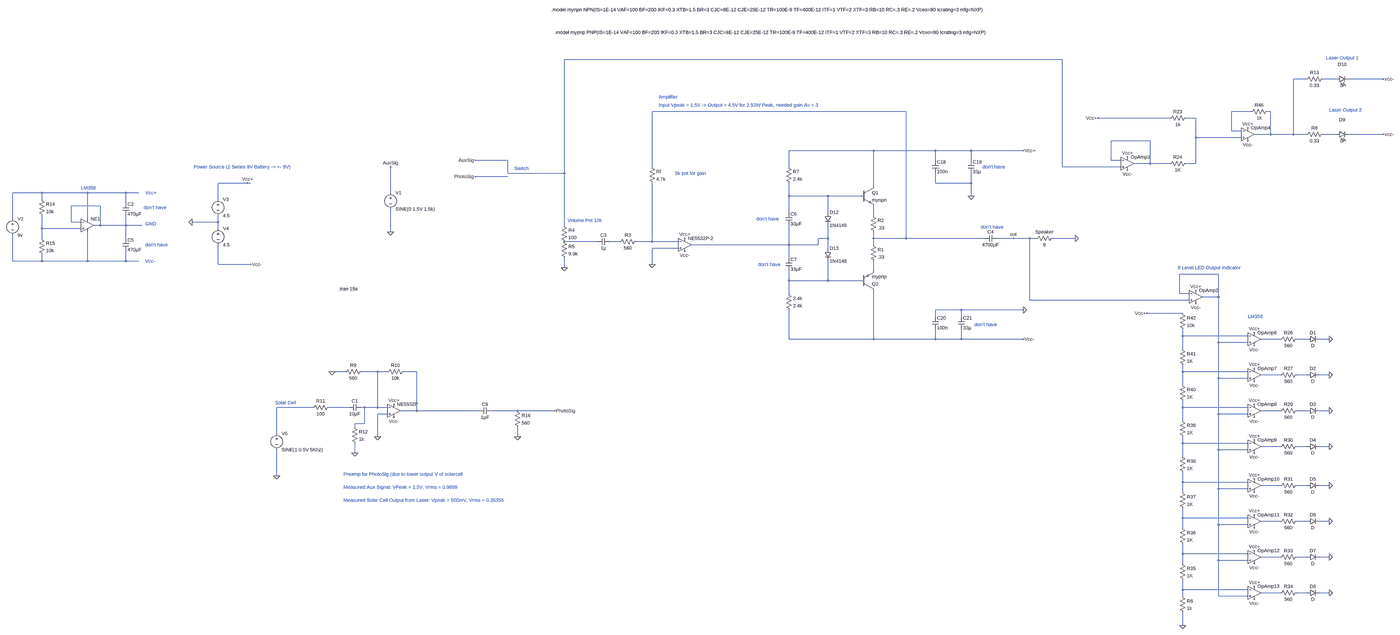
[diagram p0: schematic 20250907- Project 1 - Final.asc, whole sheet]
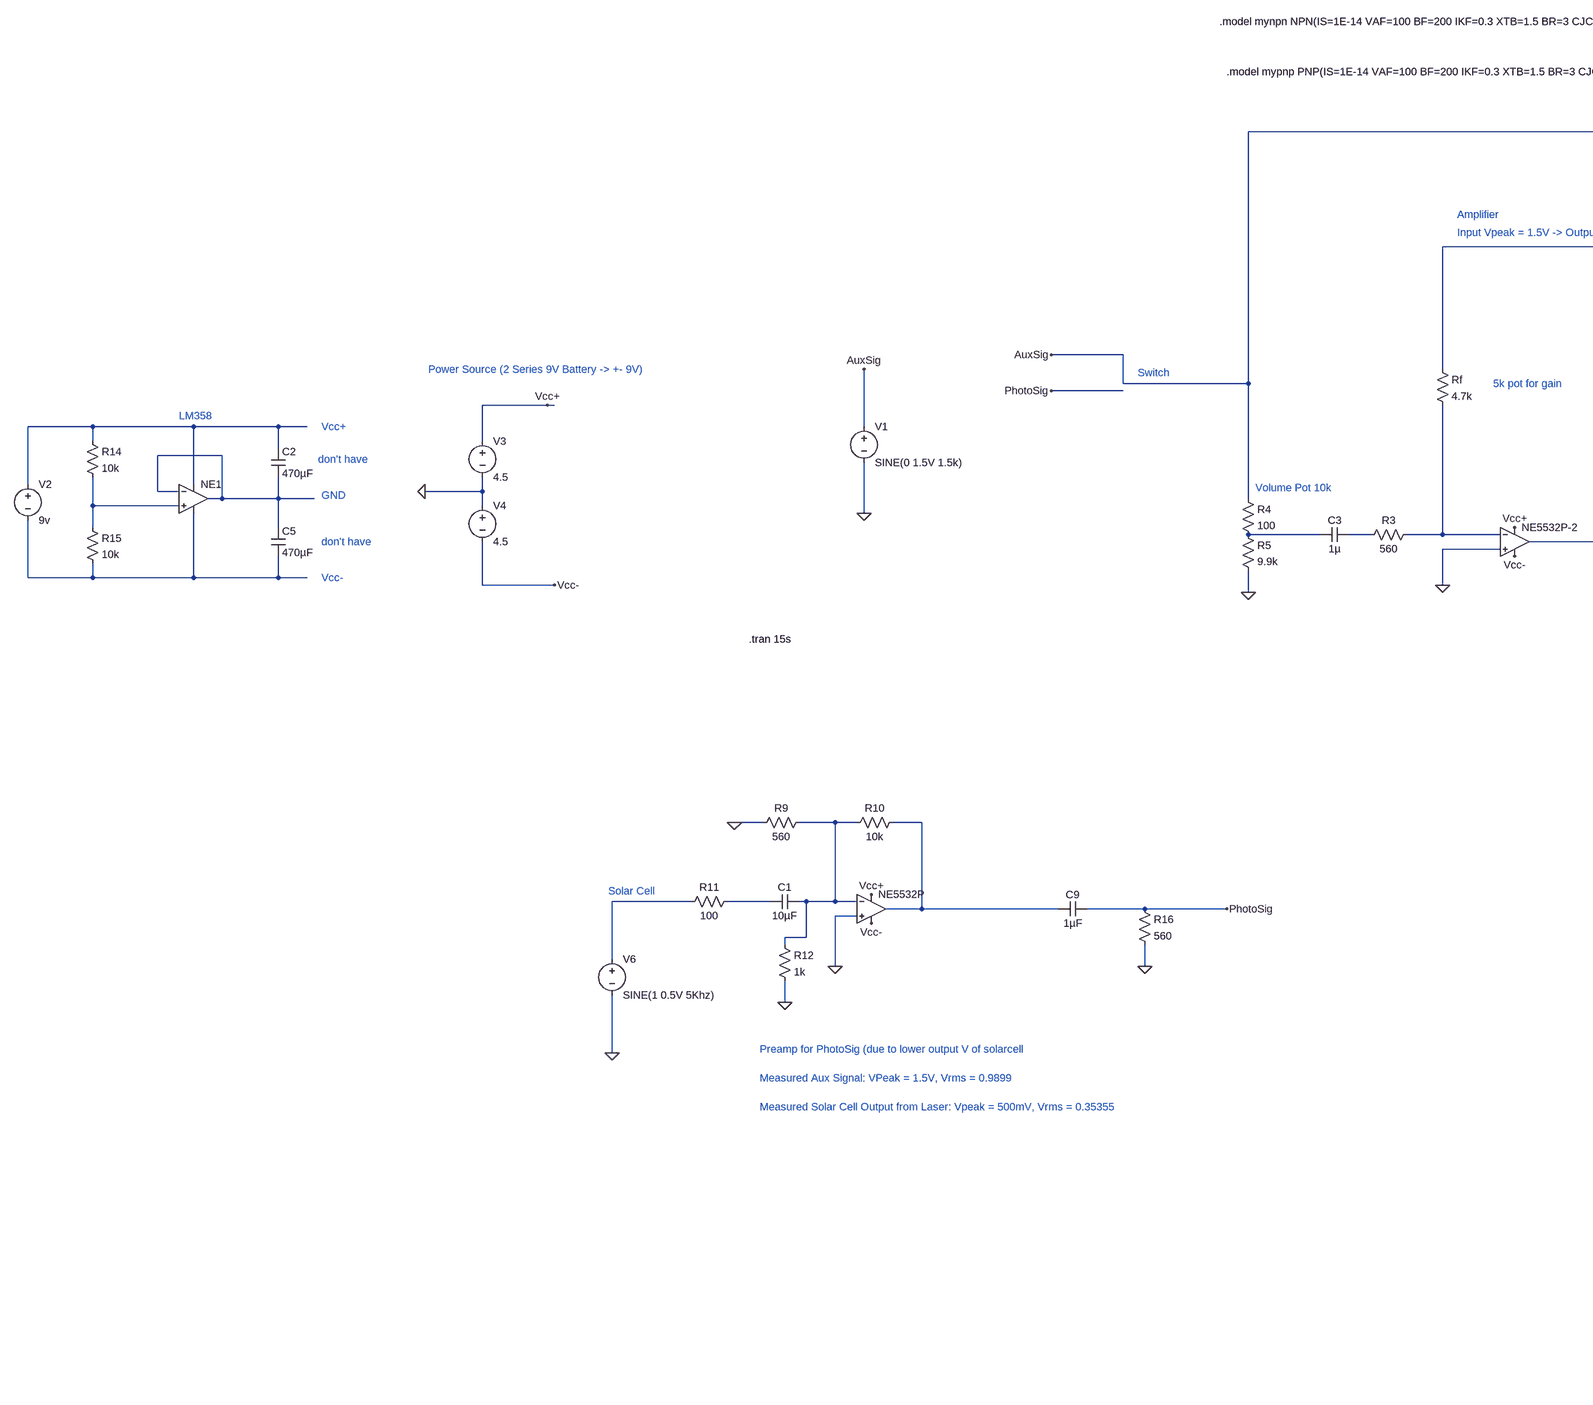
[diagram p1: schematic 20250907- Project 1 - Final.asc, part, row 1 of 1, column 1 of 2]
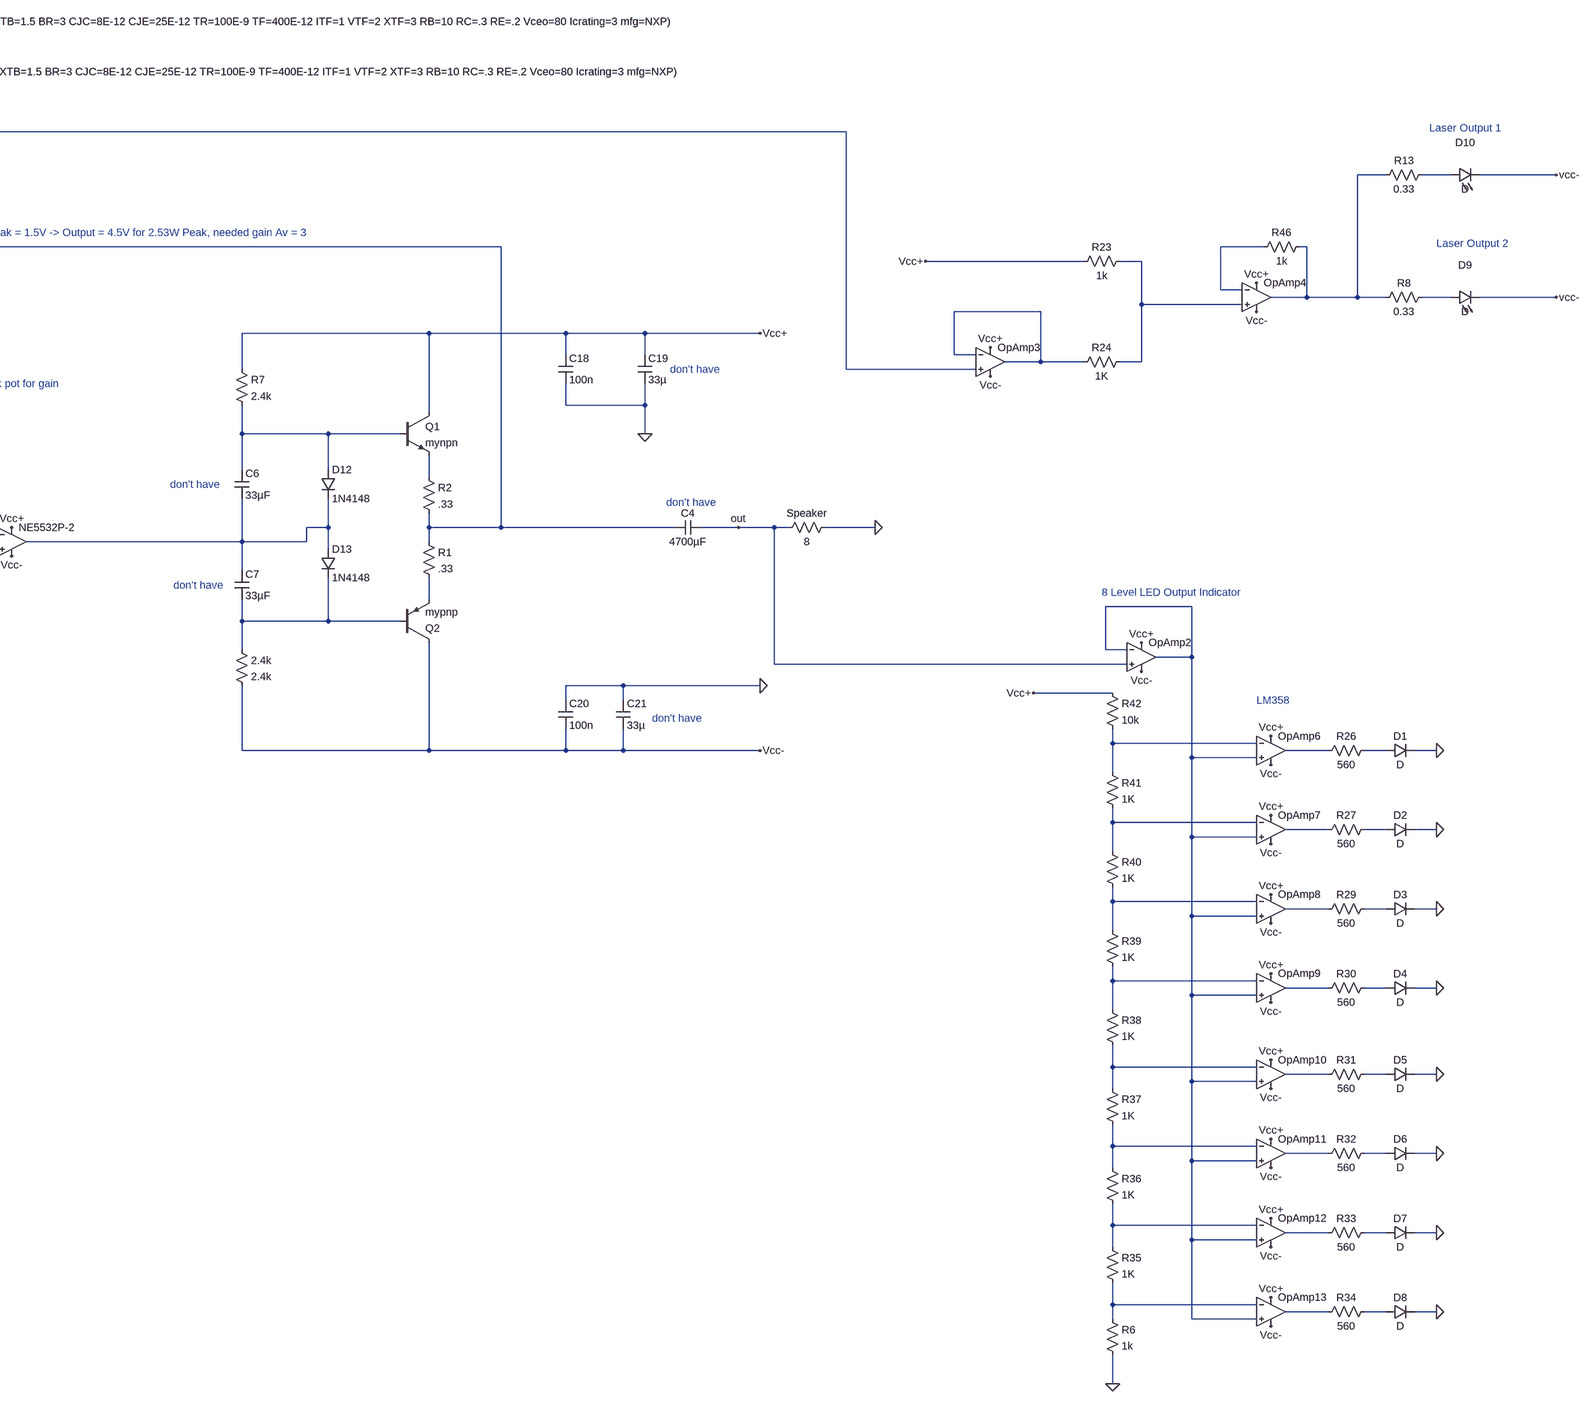
[diagram p2: schematic 20250907- Project 1 - Final.asc, part, row 1 of 1, column 2 of 2]
20250907- Project 1 - Final.asc, the LTspice schematic file:
Version 4
SHEET 1 9492 3776
WIRE 4880 -1648 2432 -1648
WIRE 6080 -1552 6016 -1552
WIRE 6224 -1552 6160 -1552
WIRE 6480 -1552 6288 -1552
WIRE 4112 -1392 2864 -1392
WIRE 5808 -1392 5712 -1392
WIRE 5904 -1392 5888 -1392
WIRE 5408 -1360 5056 -1360
WIRE 5536 -1360 5488 -1360
WIRE 5712 -1296 5712 -1392
WIRE 5760 -1296 5712 -1296
WIRE 5904 -1280 5904 -1392
WIRE 5904 -1280 5824 -1280
WIRE 6016 -1280 6016 -1552
WIRE 6016 -1280 5904 -1280
WIRE 6080 -1280 6016 -1280
WIRE 6224 -1280 6160 -1280
WIRE 6480 -1280 6288 -1280
WIRE 5536 -1264 5536 -1360
WIRE 5760 -1264 5536 -1264
WIRE 5312 -1248 5120 -1248
WIRE 3952 -1200 3536 -1200
WIRE 4256 -1200 3952 -1200
WIRE 4432 -1200 4256 -1200
WIRE 4688 -1200 4432 -1200
WIRE 2144 -1152 1984 -1152
WIRE 4256 -1152 4256 -1200
WIRE 4432 -1152 4432 -1200
WIRE 5120 -1152 5120 -1248
WIRE 5168 -1152 5120 -1152
WIRE 5312 -1136 5312 -1248
WIRE 5312 -1136 5232 -1136
WIRE 5408 -1136 5312 -1136
WIRE 5536 -1136 5536 -1264
WIRE 5536 -1136 5488 -1136
WIRE 2864 -1120 2864 -1392
WIRE 3536 -1120 3536 -1200
WIRE 4880 -1120 4880 -1648
WIRE 5168 -1120 4880 -1120
WIRE 2144 -1088 2144 -1152
WIRE 2432 -1088 2432 -1648
WIRE 2432 -1088 2144 -1088
WIRE 2144 -1072 1984 -1072
WIRE 864 -1040 720 -1040
WIRE 880 -1040 864 -1040
WIRE 4256 -1040 4256 -1088
WIRE 4432 -1040 4432 -1088
WIRE 4432 -1040 4256 -1040
WIRE 3952 -1024 3952 -1200
WIRE -288 -992 -432 -992
WIRE -64 -992 -288 -992
WIRE 128 -992 -64 -992
WIRE 192 -992 128 -992
WIRE 1568 -992 1568 -1120
WIRE 3536 -976 3536 -1040
WIRE 3728 -976 3536 -976
WIRE 3888 -976 3728 -976
WIRE 4432 -976 4432 -1040
WIRE -288 -960 -288 -992
WIRE 720 -960 720 -1040
WIRE 128 -944 128 -992
WIRE 0 -928 -144 -928
WIRE 3536 -896 3536 -976
WIRE 3728 -896 3728 -976
WIRE 3952 -880 3952 -928
WIRE -432 -864 -432 -992
WIRE -64 -864 -64 -992
WIRE -144 -848 -144 -928
WIRE -96 -848 -144 -848
WIRE 720 -848 720 -880
WIRE 720 -848 592 -848
WIRE 0 -832 0 -928
WIRE 0 -832 -32 -832
WIRE 128 -832 128 -880
WIRE 128 -832 0 -832
WIRE 208 -832 128 -832
WIRE 2432 -832 2432 -1088
WIRE -288 -816 -288 -880
WIRE -96 -816 -288 -816
WIRE 720 -816 720 -848
WIRE 1568 -800 1568 -912
WIRE -288 -768 -288 -816
WIRE 128 -768 128 -832
WIRE 3728 -768 3728 -832
WIRE 3728 -768 3680 -768
WIRE 3952 -768 3952 -800
WIRE 4112 -768 4112 -1392
WIRE 4112 -768 3952 -768
WIRE 4496 -768 4112 -768
WIRE 4640 -768 4560 -768
WIRE 4720 -768 4640 -768
WIRE 4752 -768 4720 -768
WIRE 4944 -768 4832 -768
WIRE 2592 -752 2432 -752
WIRE 2704 -752 2656 -752
WIRE 2864 -752 2864 -1040
WIRE 2864 -752 2784 -752
WIRE 2992 -752 2864 -752
WIRE 3536 -736 3536 -832
WIRE 3536 -736 3056 -736
WIRE 3680 -736 3680 -768
WIRE 3680 -736 3536 -736
WIRE 3952 -736 3952 -768
WIRE 2992 -720 2864 -720
WIRE 3728 -720 3728 -768
WIRE 3536 -672 3536 -736
WIRE -432 -656 -432 -784
WIRE -288 -656 -288 -688
WIRE -288 -656 -432 -656
WIRE -64 -656 -64 -800
WIRE -64 -656 -288 -656
WIRE 128 -656 128 -704
WIRE 128 -656 -64 -656
WIRE 192 -656 128 -656
WIRE 720 -640 720 -736
WIRE 880 -640 720 -640
WIRE 2864 -640 2864 -720
WIRE 2432 -624 2432 -672
WIRE 3952 -608 3952 -656
WIRE 5648 -592 5456 -592
WIRE 3536 -560 3536 -608
WIRE 3728 -560 3728 -656
WIRE 3728 -560 3536 -560
WIRE 3888 -560 3728 -560
WIRE 3536 -496 3536 -560
WIRE 5456 -496 5456 -592
WIRE 5504 -496 5456 -496
WIRE 5648 -480 5648 -592
WIRE 5648 -480 5568 -480
WIRE 4720 -464 4720 -768
WIRE 5504 -464 4720 -464
WIRE 4384 -416 4256 -416
WIRE 4688 -416 4384 -416
WIRE 5472 -400 5296 -400
WIRE 4256 -384 4256 -416
WIRE 4384 -384 4384 -416
WIRE 5472 -288 5472 -320
WIRE 5792 -288 5472 -288
WIRE 3536 -272 3536 -416
WIRE 3952 -272 3952 -512
WIRE 3952 -272 3536 -272
WIRE 4256 -272 4256 -320
WIRE 4256 -272 3952 -272
WIRE 4384 -272 4384 -320
WIRE 4384 -272 4256 -272
WIRE 4688 -272 4384 -272
WIRE 5952 -272 5856 -272
WIRE 6080 -272 6032 -272
WIRE 6192 -272 6144 -272
WIRE 5648 -256 5648 -480
WIRE 5792 -256 5648 -256
WIRE 5472 -224 5472 -288
WIRE 1280 -112 1264 -112
WIRE 1344 -112 1280 -112
WIRE 1504 -112 1424 -112
WIRE 1552 -112 1504 -112
WIRE 1696 -112 1632 -112
WIRE 5472 -112 5472 -144
WIRE 5792 -112 5472 -112
WIRE 5952 -96 5856 -96
WIRE 6080 -96 6032 -96
WIRE 6192 -96 6144 -96
WIRE 5648 -80 5648 -256
WIRE 5792 -80 5648 -80
WIRE 5472 -48 5472 -112
WIRE 1184 64 1008 64
WIRE 1360 64 1264 64
WIRE 1440 64 1424 64
WIRE 1504 64 1504 -112
WIRE 1504 64 1440 64
WIRE 1552 64 1504 64
WIRE 5472 64 5472 32
WIRE 5792 64 5472 64
WIRE 1696 80 1696 -112
WIRE 1696 80 1616 80
WIRE 2000 80 1696 80
WIRE 2192 80 2064 80
WIRE 2384 80 2192 80
WIRE 5952 80 5856 80
WIRE 6080 80 6032 80
WIRE 6192 80 6144 80
WIRE 1552 96 1504 96
WIRE 5648 96 5648 -80
WIRE 5792 96 5648 96
WIRE 5472 128 5472 64
WIRE 1440 144 1440 64
WIRE 1440 144 1392 144
WIRE 1392 160 1392 144
WIRE 1008 192 1008 64
WIRE 1504 208 1504 96
WIRE 2192 208 2192 160
WIRE 5472 240 5472 208
WIRE 5792 240 5472 240
WIRE 5952 256 5856 256
WIRE 6080 256 6032 256
WIRE 6192 256 6144 256
WIRE 5648 272 5648 96
WIRE 5792 272 5648 272
WIRE 1392 288 1392 240
WIRE 5472 304 5472 240
WIRE 1008 400 1008 272
WIRE 5472 432 5472 384
WIRE 5792 432 5472 432
WIRE 5952 448 5856 448
WIRE 6080 448 6032 448
WIRE 6192 448 6144 448
WIRE 5648 464 5648 272
WIRE 5792 464 5648 464
WIRE 5472 480 5472 432
WIRE 5472 608 5472 560
WIRE 5792 608 5472 608
WIRE 5952 624 5856 624
WIRE 6080 624 6032 624
WIRE 6192 624 6144 624
WIRE 5648 640 5648 464
WIRE 5792 640 5648 640
WIRE 5472 656 5472 608
WIRE 5472 784 5472 736
WIRE 5792 784 5472 784
WIRE 5952 800 5856 800
WIRE 6080 800 6032 800
WIRE 6192 800 6144 800
WIRE 5648 816 5648 640
WIRE 5792 816 5648 816
WIRE 5472 832 5472 784
WIRE 5472 960 5472 912
WIRE 5792 960 5472 960
WIRE 5952 976 5856 976
WIRE 6080 976 6032 976
WIRE 6192 976 6144 976
WIRE 5472 992 5472 960
WIRE 5648 992 5648 816
WIRE 5792 992 5648 992
WIRE 5472 1136 5472 1072
FLAG 1568 -1120 AuxSig
FLAG 6192 -96 0
FLAG 6192 80 0
FLAG 6192 256 0
FLAG 6192 448 0
FLAG 6192 624 0
FLAG 6192 800 0
FLAG 6192 976 0
FLAG 5296 -400 Vcc+
FLAG 6192 -272 0
FLAG 5056 -1360 Vcc+
FLAG 3024 -768 Vcc+
FLAG 3024 -704 Vcc-
FLAG 2864 -640 0
FLAG 4944 -768 0
FLAG 4640 -768 out
FLAG 4432 -976 0
FLAG 4688 -416 0
FLAG 4688 -272 Vcc-
FLAG 4688 -1200 Vcc+
FLAG 5536 -512 Vcc+
FLAG 5536 -448 Vcc-
FLAG 5200 -1168 Vcc+
FLAG 5200 -1104 Vcc-
FLAG 5792 -1312 Vcc+
FLAG 5792 -1248 Vcc-
FLAG 5824 -304 Vcc+
FLAG 5824 -240 Vcc-
FLAG 5824 -128 Vcc+
FLAG 5824 -64 Vcc-
FLAG 5824 48 Vcc+
FLAG 5824 112 Vcc-
FLAG 5824 224 Vcc+
FLAG 5824 288 Vcc-
FLAG 5824 416 Vcc+
FLAG 5824 480 Vcc-
FLAG 5824 592 Vcc+
FLAG 5824 656 Vcc-
FLAG 5824 768 Vcc+
FLAG 5824 832 Vcc-
FLAG 5824 944 Vcc+
FLAG 5824 1008 Vcc-
FLAG 2432 -624 0
FLAG 1504 208 0
FLAG 1584 48 Vcc+
FLAG 1584 112 Vcc-
FLAG 2384 80 PhotoSig
FLAG 592 -848 0
FLAG 864 -1040 Vcc+
FLAG 880 -640 Vcc-
FLAG 6480 -1280 vcc-
FLAG 1008 400 0
FLAG 5472 1136 0
FLAG 1984 -1152 AuxSig
FLAG 1984 -1072 PhotoSig
FLAG 1280 -112 0
FLAG 1392 288 0
FLAG 6480 -1552 vcc-
FLAG 1568 -800 0
FLAG 2192 208 0
SYMBOL diode 6080 -256 R270
WINDOW 0 32 32 VTop 2
WINDOW 3 0 32 VBottom 2
SYMATTR InstName D1
SYMBOL res 6048 -288 R90
WINDOW 0 0 56 VBottom 2
WINDOW 3 32 56 VTop 2
SYMATTR InstName R26
SYMATTR Value 560
SYMBOL diode 6080 -80 R270
WINDOW 0 32 32 VTop 2
WINDOW 3 0 32 VBottom 2
SYMATTR InstName D2
SYMBOL res 6048 -112 R90
WINDOW 0 0 56 VBottom 2
WINDOW 3 32 56 VTop 2
SYMATTR InstName R27
SYMATTR Value 560
SYMBOL diode 6080 96 R270
WINDOW 0 32 32 VTop 2
WINDOW 3 0 32 VBottom 2
SYMATTR InstName D3
SYMBOL res 6048 64 R90
WINDOW 0 0 56 VBottom 2
WINDOW 3 32 56 VTop 2
SYMATTR InstName R29
SYMATTR Value 560
SYMBOL diode 6080 272 R270
WINDOW 0 32 32 VTop 2
WINDOW 3 0 32 VBottom 2
SYMATTR InstName D4
SYMBOL res 6048 240 R90
WINDOW 0 0 56 VBottom 2
WINDOW 3 32 56 VTop 2
SYMATTR InstName R30
SYMATTR Value 560
SYMBOL diode 6080 464 R270
WINDOW 0 32 32 VTop 2
WINDOW 3 0 32 VBottom 2
SYMATTR InstName D5
SYMBOL res 6048 432 R90
WINDOW 0 0 56 VBottom 2
WINDOW 3 32 56 VTop 2
SYMATTR InstName R31
SYMATTR Value 560
SYMBOL diode 6080 640 R270
WINDOW 0 32 32 VTop 2
WINDOW 3 0 32 VBottom 2
SYMATTR InstName D6
SYMBOL res 6048 608 R90
WINDOW 0 0 56 VBottom 2
WINDOW 3 32 56 VTop 2
SYMATTR InstName R32
SYMATTR Value 560
SYMBOL diode 6080 816 R270
WINDOW 0 32 32 VTop 2
WINDOW 3 0 32 VBottom 2
SYMATTR InstName D7
SYMBOL res 6048 784 R90
WINDOW 0 0 56 VBottom 2
WINDOW 3 32 56 VTop 2
SYMATTR InstName R33
SYMATTR Value 560
SYMBOL diode 6080 992 R270
WINDOW 0 32 32 VTop 2
WINDOW 3 0 32 VBottom 2
SYMATTR InstName D8
SYMBOL res 6048 960 R90
WINDOW 0 0 56 VBottom 2
WINDOW 3 32 56 VTop 2
SYMATTR InstName R34
SYMATTR Value 560
SYMBOL res 5456 816 R0
SYMATTR InstName R35
SYMATTR Value 1K
SYMBOL res 5456 640 R0
SYMATTR InstName R36
SYMATTR Value 1K
SYMBOL res 5456 464 R0
SYMATTR InstName R37
SYMATTR Value 1K
SYMBOL res 5456 288 R0
SYMATTR InstName R38
SYMATTR Value 1K
SYMBOL res 5456 112 R0
SYMATTR InstName R39
SYMATTR Value 1K
SYMBOL res 5456 -64 R0
SYMATTR InstName R40
SYMATTR Value 1K
SYMBOL res 5456 -240 R0
SYMATTR InstName R41
SYMATTR Value 1K
SYMBOL res 5456 -416 R0
SYMATTR InstName R42
SYMATTR Value 10k
SYMBOL res 5904 -1408 R90
WINDOW 0 0 56 VBottom 2
WINDOW 3 32 56 VTop 2
SYMATTR InstName R46
SYMATTR Value 1k
SYMBOL res 5504 -1376 R90
WINDOW 0 0 56 VBottom 2
WINDOW 3 32 56 VTop 2
SYMATTR InstName R23
SYMATTR Value 1k
SYMBOL res 5504 -1152 R90
WINDOW 0 0 56 VBottom 2
WINDOW 3 32 56 VTop 2
SYMATTR InstName R24
SYMATTR Value 1K
SYMBOL OpAmps\\UniversalOpAmp2 3024 -736 R0
SYMATTR InstName NE5532P-2
SYMATTR SpiceLine Ilimit=70m Rail=0 Vos=0
SYMATTR SpiceLine2 En=0 Enk=0 In=0 Ink=0 Rin=300k
SYMBOL cap 2656 -768 R90
WINDOW 0 0 32 VBottom 2
WINDOW 3 32 32 VTop 2
SYMATTR InstName C3
SYMATTR Value 1µ
SYMBOL res 2800 -768 R90
WINDOW 0 0 56 VBottom 2
WINDOW 3 32 56 VTop 2
SYMATTR InstName R3
SYMATTR Value 560
SYMBOL res 4848 -784 R90
WINDOW 0 0 56 VBottom 2
WINDOW 3 32 56 VTop 2
SYMATTR InstName Speaker
SYMATTR Value 8
SYMBOL cap 4560 -784 R90
WINDOW 0 0 32 VBottom 2
WINDOW 3 32 32 VTop 2
SYMATTR InstName C4
SYMATTR Value 4700µF
SYMBOL cap 3520 -896 R0
SYMATTR InstName C6
SYMATTR Value 33µF
SYMBOL cap 3520 -672 R0
SYMATTR InstName C7
SYMATTR Value 33µF
SYMBOL res 3520 -512 R0
SYMATTR InstName 2.4k
SYMATTR Value 2.4k
SYMBOL res 3520 -1136 R0
SYMATTR InstName R7
SYMATTR Value 2.4k
SYMBOL diode 3712 -896 R0
SYMATTR InstName D12
SYMATTR Value 1N4148
SYMBOL diode 3712 -720 R0
SYMATTR InstName D13
SYMATTR Value 1N4148
SYMBOL cap 4240 -1152 R0
SYMATTR InstName C18
SYMATTR Value 100n
SYMBOL cap 4416 -1152 R0
SYMATTR InstName C19
SYMATTR Value 33µ
SYMBOL cap 4240 -384 R0
SYMATTR InstName C20
SYMATTR Value 100n
SYMBOL cap 4368 -384 R0
SYMATTR InstName C21
SYMATTR Value 33µ
SYMBOL res 2848 -1136 R0
SYMATTR InstName Rf
SYMATTR Value 4.7k
SYMBOL OpAmps\\UniversalOpAmp2 5536 -480 R0
SYMATTR InstName OpAmp2
SYMATTR SpiceLine Ilimit=70m Rail=0 Vos=0
SYMATTR SpiceLine2 En=0 Enk=0 In=0 Ink=0 Rin=300k
SYMBOL OpAmps\\UniversalOpAmp2 5200 -1136 R0
SYMATTR InstName OpAmp3
SYMATTR SpiceLine Ilimit=70m Rail=0 Vos=0
SYMATTR SpiceLine2 En=0 Enk=0 In=0 Ink=0 Rin=300k
SYMBOL OpAmps\\UniversalOpAmp2 5792 -1280 R0
SYMATTR InstName OpAmp4
SYMATTR SpiceLine Ilimit=70m Rail=0 Vos=0
SYMATTR SpiceLine2 En=0 Enk=0 In=0 Ink=0 Rin=300k
SYMBOL OpAmps\\UniversalOpAmp2 5824 -272 R0
SYMATTR InstName OpAmp6
SYMATTR SpiceLine Ilimit=70m Rail=0 Vos=0
SYMATTR SpiceLine2 En=0 Enk=0 In=0 Ink=0 Rin=300k
SYMBOL OpAmps\\UniversalOpAmp2 5824 -96 R0
SYMATTR InstName OpAmp7
SYMATTR SpiceLine Ilimit=70m Rail=0 Vos=0
SYMATTR SpiceLine2 En=0 Enk=0 In=0 Ink=0 Rin=300k
SYMBOL OpAmps\\UniversalOpAmp2 5824 80 R0
SYMATTR InstName OpAmp8
SYMATTR SpiceLine Ilimit=70m Rail=0 Vos=0
SYMATTR SpiceLine2 En=0 Enk=0 In=0 Ink=0 Rin=300k
SYMBOL OpAmps\\UniversalOpAmp2 5824 256 R0
SYMATTR InstName OpAmp9
SYMATTR SpiceLine Ilimit=70m Rail=0 Vos=0
SYMATTR SpiceLine2 En=0 Enk=0 In=0 Ink=0 Rin=300k
SYMBOL OpAmps\\UniversalOpAmp2 5824 448 R0
SYMATTR InstName OpAmp10
SYMATTR SpiceLine Ilimit=70m Rail=0 Vos=0
SYMATTR SpiceLine2 En=0 Enk=0 In=0 Ink=0 Rin=300k
SYMBOL OpAmps\\UniversalOpAmp2 5824 624 R0
SYMATTR InstName OpAmp11
SYMATTR SpiceLine Ilimit=70m Rail=0 Vos=0
SYMATTR SpiceLine2 En=0 Enk=0 In=0 Ink=0 Rin=300k
SYMBOL OpAmps\\UniversalOpAmp2 5824 800 R0
SYMATTR InstName OpAmp12
SYMATTR SpiceLine Ilimit=70m Rail=0 Vos=0
SYMATTR SpiceLine2 En=0 Enk=0 In=0 Ink=0 Rin=300k
SYMBOL OpAmps\\UniversalOpAmp2 5824 976 R0
SYMATTR InstName OpAmp13
SYMATTR SpiceLine Ilimit=70m Rail=0 Vos=0
SYMATTR SpiceLine2 En=0 Enk=0 In=0 Ink=0 Rin=300k
SYMBOL res 2416 -848 R0
SYMATTR InstName R4
SYMATTR Value 100
SYMBOL res 2416 -768 R0
SYMATTR InstName R5
SYMATTR Value 9.9k
SYMBOL res 1648 -128 R90
WINDOW 0 0 56 VBottom 2
WINDOW 3 32 56 VTop 2
SYMATTR InstName R10
SYMATTR Value 10k
SYMBOL OpAmps\\UniversalOpAmp2 1584 80 R0
SYMATTR InstName NE5532P
SYMATTR SpiceLine Ilimit=70m Rail=0 Vos=0
SYMATTR SpiceLine2 En=0 Enk=0 In=0 Ink=0 Rin=300k
SYMBOL res 1280 48 R90
WINDOW 0 0 56 VBottom 2
WINDOW 3 32 56 VTop 2
SYMATTR InstName R11
SYMATTR Value 100
SYMBOL voltage 720 -976 R0
WINDOW 123 0 0 Left 0
WINDOW 39 0 0 Left 0
SYMATTR InstName V3
SYMATTR Value 4.5
SYMBOL voltage 720 -832 R0
WINDOW 123 0 0 Left 0
WINDOW 39 0 0 Left 0
SYMATTR InstName V4
SYMATTR Value 4.5
SYMBOL res 3936 -752 R0
SYMATTR InstName R1
SYMATTR Value .33
SYMBOL res 3936 -896 R0
SYMATTR InstName R2
SYMATTR Value .33
SYMBOL npn 3888 -1024 R0
SYMATTR InstName Q1
SYMATTR Value mynpn
SYMBOL pnp 3888 -512 M180
SYMATTR InstName Q2
SYMATTR Value mypnp
SYMBOL res 5456 976 R0
SYMATTR InstName R6
SYMATTR Value 1k
SYMBOL res 6176 -1296 R90
WINDOW 0 0 56 VBottom 2
WINDOW 3 32 56 VTop 2
SYMATTR InstName R8
SYMATTR Value 0.33
SYMBOL LED 6224 -1264 R270
WINDOW 0 72 32 VTop 2
WINDOW 3 0 32 VBottom 2
SYMATTR InstName D9
SYMBOL voltage 1008 176 R0
WINDOW 123 0 0 Left 0
WINDOW 39 0 0 Left 0
SYMATTR InstName V6
SYMATTR Value SINE(1 0.5V 5Khz)
SYMBOL res 1440 -128 R90
WINDOW 0 0 56 VBottom 2
WINDOW 3 32 56 VTop 2
SYMATTR InstName R9
SYMATTR Value 560
SYMBOL cap 1424 48 R90
WINDOW 0 0 32 VBottom 2
WINDOW 3 32 32 VTop 2
SYMATTR InstName C1
SYMATTR Value 10µF
SYMBOL res 1376 144 R0
SYMATTR InstName R12
SYMATTR Value 1k
SYMBOL res 6176 -1568 R90
WINDOW 0 0 56 VBottom 2
WINDOW 3 32 56 VTop 2
SYMATTR InstName R13
SYMATTR Value 0.33
SYMBOL LED 6224 -1536 R270
WINDOW 0 72 32 VTop 2
WINDOW 3 0 32 VBottom 2
SYMATTR InstName D10
SYMBOL voltage 1568 -1008 R0
WINDOW 123 0 0 Left 0
WINDOW 39 0 0 Left 0
SYMATTR InstName V1
SYMATTR Value SINE(0 1.5V 1.5k)
SYMBOL OpAmps\\UniversalOpAmp2 -64 -832 R0
SYMATTR InstName NE1
SYMATTR SpiceLine Ilimit=70m Rail=0 Vos=0
SYMATTR SpiceLine2 En=0 Enk=0 In=0 Ink=0 Rin=300k
SYMBOL res -304 -976 R0
SYMATTR InstName R14
SYMATTR Value 10k
SYMBOL res -304 -784 R0
SYMATTR InstName R15
SYMATTR Value 10k
SYMBOL voltage -432 -880 R0
WINDOW 123 0 0 Left 0
WINDOW 39 0 0 Left 0
SYMATTR InstName V2
SYMATTR Value 9v
SYMBOL cap 112 -944 R0
SYMATTR InstName C2
SYMATTR Value 470µF
SYMBOL cap 112 -768 R0
SYMATTR InstName C5
SYMATTR Value 470µF
SYMBOL cap 2064 64 R90
WINDOW 0 0 32 VBottom 2
WINDOW 3 32 32 VTop 2
SYMATTR InstName C9
SYMATTR Value 1µF
SYMBOL res 2176 64 R0
SYMATTR InstName R16
SYMATTR Value 560
TEXT 1312 -520 Left 2 !.tran 15s
TEXT 600 -1120 Left 2 ;Power Source (2 Series 9V Battery -> +- 9V)
TEXT 5448 -624 Left 2 ;8 Level LED Output Indicator
TEXT 6192 -1400 Left 2 ;Laser Output 2
TEXT 1336 456 Left 2 ;Measured Aux Signal: VPeak = 1.5V, Vrms = 0.9899
TEXT 1336 520 Left 2 ;Measured Solar Cell Output from Laser: Vpeak = 500mV, Vrms = 0.35355
TEXT 2896 -1464 Left 2 ;Amplifier
TEXT 2896 -1424 Left 2 ;Input Vpeak = 1.5V -> Output = 4.5V for 2.53W Peak, needed gain Av = 3
TEXT 2448 -856 Left 2 ;Volume Pot 10k
TEXT 1336 392 Left 2 ;Preamp for PhotoSig (due to lower output V of solarcell
TEXT 2368 -1920 Left 2 !.model mynpn NPN(IS=1E-14 VAF=100 BF=200 IKF=0.3 XTB=1.5 BR=3 CJC=8E-12 CJE=25E-12 TR=100E-9 TF=400E-12 ITF=1 VTF=2 XTF=3 RB=10 RC=.3 RE=.2 Vceo=80 Icrating=3 mfg=NXP)
TEXT 2384 -1808 Left 2 !.model mypnp PNP(IS=1E-14 VAF=100 BF=200 IKF=0.3 XTB=1.5 BR=3 CJC=8E-12 CJE=25E-12 TR=100E-9 TF=400E-12 ITF=1 VTF=2 XTF=3 RB=10 RC=.3 RE=.2 Vceo=80 Icrating=3 mfg=NXP)
TEXT 6176 -1656 Left 2 ;Laser Output 1
TEXT 1000 40 Left 2 ;Solar Cell
TEXT 224 -840 Left 2 ;GND
TEXT 224 -992 Left 2 ;Vcc+
TEXT 224 -656 Left 2 ;Vcc-
TEXT 2976 -1088 Left 2 ;5k pot for gain
TEXT 2176 -1112 Left 2 ;Switch
TEXT 5792 -384 Left 2 ;LM358
TEXT -96 -1016 Left 2 ;LM358
TEXT 216 -920 Left 2 ;don't have
TEXT 224 -736 Left 2 ;don't have
TEXT 3376 -864 Left 2 ;don't have
TEXT 3384 -640 Left 2 ;don't have
TEXT 4488 -1120 Left 2 ;don't have
TEXT 4448 -344 Left 2 ;don't have
TEXT 4480 -824 Left 2 ;don't have

The netlist it stands for:
* 20250907- Project 1 - Final.asc
D1 N023 0 D
R26 N023 N022 560
D2 N028 0 D
R27 N028 N027 560
D3 N033 0 D
R29 N033 N032 560
D4 N036 0 D
R30 N036 N035 560
D5 N039 0 D
R31 N039 N038 560
D6 N042 0 D
R32 N042 N041 560
D7 N045 0 D
R33 N045 N044 560
D8 N048 0 D
R34 N048 N047 560
R35 N043 N046 1K
R36 N040 N043 1K
R37 N037 N040 1K
R38 N034 N037 1K
R39 N031 N034 1K
R40 N026 N031 1K
R41 N021 N026 1K
R42 Vcc+ N021 10k
R46 N001 N004 1k
R23 N005 Vcc+ 1k
R24 N005 N007 1K
XNE5532P-2 0 N016 Vcc+ Vcc- N013 level2 Avol=1Meg GBW=10Meg Slew=10Meg Ilimit=70m Rail=0 Vos=0 En=0 Enk=0 In=0 Ink=0 Rin=300k  ; pins In+ In- V+ V- OUT
C3 N015 N014 1µ
R3 N016 N015 560
R§Speaker 0 out 8
C4 out N003 4700µF
C6 N009 N013 33µF
C7 N013 N020 33µF
R§2.4k N020 Vcc- 2.4k
R7 Vcc+ N009 2.4k
D12 N009 N013 1N4148
D13 N013 N020 1N4148
C18 Vcc+ 0 100n
C19 Vcc+ 0 33µ
C20 0 Vcc- 100n
C21 0 Vcc- 33µ
Rf N003 N016 4.7k
XOpAmp2 out N019 Vcc+ Vcc- N019 level2 Avol=1Meg GBW=10Meg Slew=10Meg Ilimit=70m Rail=0 Vos=0 En=0 Enk=0 In=0 Ink=0 Rin=300k  ; pins In+ In- V+ V- OUT
XOpAmp3 AuxSig N007 Vcc+ Vcc- N007 level2 Avol=1Meg GBW=10Meg Slew=10Meg Ilimit=70m Rail=0 Vos=0 En=0 Enk=0 In=0 Ink=0 Rin=300k  ; pins In+ In- V+ V- OUT
XOpAmp4 N005 N004 Vcc+ Vcc- N001 level2 Avol=1Meg GBW=10Meg Slew=10Meg Ilimit=70m Rail=0 Vos=0 En=0 Enk=0 In=0 Ink=0 Rin=300k  ; pins In+ In- V+ V- OUT
XOpAmp6 N019 N021 Vcc+ Vcc- N022 level2 Avol=1Meg GBW=10Meg Slew=10Meg Ilimit=70m Rail=0 Vos=0 En=0 Enk=0 In=0 Ink=0 Rin=300k  ; pins In+ In- V+ V- OUT
XOpAmp7 N019 N026 Vcc+ Vcc- N027 level2 Avol=1Meg GBW=10Meg Slew=10Meg Ilimit=70m Rail=0 Vos=0 En=0 Enk=0 In=0 Ink=0 Rin=300k  ; pins In+ In- V+ V- OUT
XOpAmp8 N019 N031 Vcc+ Vcc- N032 level2 Avol=1Meg GBW=10Meg Slew=10Meg Ilimit=70m Rail=0 Vos=0 En=0 Enk=0 In=0 Ink=0 Rin=300k  ; pins In+ In- V+ V- OUT
XOpAmp9 N019 N034 Vcc+ Vcc- N035 level2 Avol=1Meg GBW=10Meg Slew=10Meg Ilimit=70m Rail=0 Vos=0 En=0 Enk=0 In=0 Ink=0 Rin=300k  ; pins In+ In- V+ V- OUT
XOpAmp10 N019 N037 Vcc+ Vcc- N038 level2 Avol=1Meg GBW=10Meg Slew=10Meg Ilimit=70m Rail=0 Vos=0 En=0 Enk=0 In=0 Ink=0 Rin=300k  ; pins In+ In- V+ V- OUT
XOpAmp11 N019 N040 Vcc+ Vcc- N041 level2 Avol=1Meg GBW=10Meg Slew=10Meg Ilimit=70m Rail=0 Vos=0 En=0 Enk=0 In=0 Ink=0 Rin=300k  ; pins In+ In- V+ V- OUT
XOpAmp12 N019 N043 Vcc+ Vcc- N044 level2 Avol=1Meg GBW=10Meg Slew=10Meg Ilimit=70m Rail=0 Vos=0 En=0 Enk=0 In=0 Ink=0 Rin=300k  ; pins In+ In- V+ V- OUT
XOpAmp13 N019 N046 Vcc+ Vcc- N047 level2 Avol=1Meg GBW=10Meg Slew=10Meg Ilimit=70m Rail=0 Vos=0 En=0 Enk=0 In=0 Ink=0 Rin=300k  ; pins In+ In- V+ V- OUT
R4 AuxSig N014 100
R5 N014 0 9.9k
R10 N025 N024 10k
XNE5532P 0 N024 Vcc+ Vcc- N025 level2 Avol=1Meg GBW=10Meg Slew=10Meg Ilimit=70m Rail=0 Vos=0 En=0 Enk=0 In=0 Ink=0 Rin=300k  ; pins In+ In- V+ V- OUT
R11 N030 N029 100
V3 Vcc+ 0 4.5
V4 0 Vcc- 4.5
R1 N003 N018 .33
R2 N011 N003 .33
Q1 Vcc+ N009 N011 0 mynpn
Q2 Vcc- N020 N018 0 mypnp
R6 N046 0 1k
R8 N006 N001 0.33
D9 N006 Vcc- D
V6 N029 0 SINE(1 0.5V 5Khz)
R9 N024 0 560
C1 N024 N030 10µF
R12 N024 0 1k
R13 N002 N001 0.33
D10 N002 Vcc- D
V1 AuxSig 0 SINE(0 1.5V 1.5k)
XNE1 N012 N010 N008 N017 N010 level2 Avol=1Meg GBW=10Meg Slew=10Meg Ilimit=70m Rail=0 Vos=0 En=0 Enk=0 In=0 Ink=0 Rin=300k  ; pins In+ In- V+ V- OUT
R14 N008 N012 10k
R15 N012 N017 10k
V2 N008 N017 9v
C2 N008 N010 470µF
C5 N010 N017 470µF
C9 PhotoSig N025 1µF
R16 PhotoSig 0 560
.model D D
.lib standard.dio
.model NPN NPN
.model PNP PNP
.lib standard.bjt
.tran 15s
* Power Source (2 Series 9V Battery -> +- 9V)
* 8 Level LED Output Indicator
* Laser Output 2
* Measured Aux Signal: VPeak = 1.5V, Vrms = 0.9899
* Measured Solar Cell Output from Laser: Vpeak = 500mV, Vrms = 0.35355
* Amplifier
* Input Vpeak = 1.5V -> Output = 4.5V for 2.53W Peak, needed gain Av = 3
* Volume Pot 10k
* Preamp for PhotoSig (due to lower output V of solarcell
.model mynpn NPN(IS=1E-14 VAF=100 BF=200 IKF=0.3 XTB=1.5 BR=3 CJC=8E-12 CJE=25E-12 TR=100E-9 TF=400E-12 ITF=1 VTF=2 XTF=3 RB=10 RC=.3 RE=.2 Vceo=80 Icrating=3 mfg=NXP)
.model mypnp PNP(IS=1E-14 VAF=100 BF=200 IKF=0.3 XTB=1.5 BR=3 CJC=8E-12 CJE=25E-12 TR=100E-9 TF=400E-12 ITF=1 VTF=2 XTF=3 RB=10 RC=.3 RE=.2 Vceo=80 Icrating=3 mfg=NXP)
* Laser Output 1
* Solar Cell
* GND
* Vcc+
* Vcc-
* 5k pot for gain
* Switch
* LM358
* LM358
* don't have
* don't have
* don't have
* don't have
* don't have
* don't have
* don't have
.lib UniversalOpAmp2.lib
.backanno
.end